# Altium schematic sheet coil_driver.SchDoc: Fan Driver
size 431 x 279 mm; Author: Shivam Sharma; DrawnBy: Fans; SheetNumber: 5; SheetTotal: 14; SheetRevision: 1.0
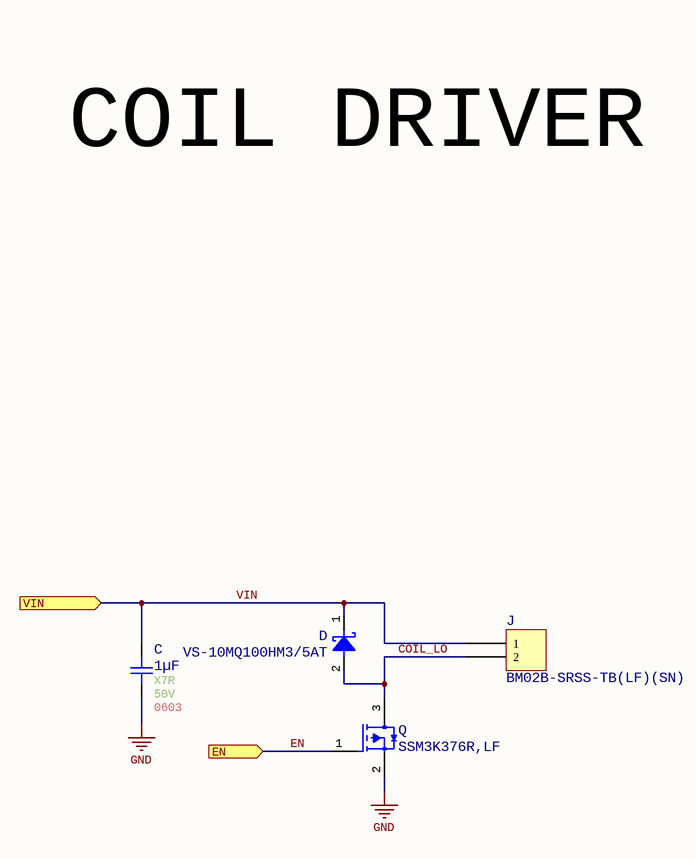
[diagram p0: coil_driver.SchDoc]

## Parts
C  value 1µF  Temperature Coefficient: X7R  Voltage Rating: 50V  Case/Package: 0603  [Generic 0603 Capacitor]  (hidden comment: CGA3E3X7R1H105K080AB)
D  VS-10MQ100HM3/5AT  [FP-95400-MFG]
J  BM02B-SRSS-TB(LF)(SN)  [JST BM02B-SRSS-TB]
Q  SSM3K376R,LF  [SSM3K376R,LF]

## Ports
EN (in), VIN (in)

## Nets
GND: C.1 Q.2(S)
COIL_LO: D.2(A) J.2 Q.3(D)
EN: Q.1(G) ; port EN
VIN: C.2 D.1(C) J.1 ; port VIN

## Notes on the sheet
- COIL DRIVER
- Title:
- Author:
- Approved:
- Size:
- Date:
- Git Hash:
- Sch Revision:
- B
- Prj:
- Sheet Revision:
- Variant:
- Edited:
- CONFIDENTIAL
- File:

## Library data of the parts
C = CMP-001-00097-2: Automotive Grade, Mlcc, 0603, X7R, 5; Tolerance: 10%; AECQ: Yes; Capacitor Type: Ceramic; RoHS Compliant: Yes; Pins: 2; Max Operating Temperature: 125°C; Min Operating Temperature: -55°C
D = CMP-00005-4: Rectifier Diode, Schottky, 1 Phase, 1 Element, 1.5A, 100V V(RRM), Silicon, DO-214AC; AECQ: Yes; Package Body Material: Plastic; Reference Standard: AEC-Q101; Forward Voltage: 780mV; Number of Elements: 1; Forward Current: 1A; Time @ Peak Reflow Temperature-Max (s): 10s; Reach SVHC Compliant: No; Terminal Finish: Tin; Surface Mount: Yes; Peak Reflow Temperature (Cel): 260°C; Package Style: SMALL OUTLINEMeter; JEDEC-95 Code: DO-214AC; Max Operating Temperature: 150°C; RoHS Compliant: Yes; Case/Package: DO-214AC; Diode Element Material: SILICON; Min Operating Temperature: -55°C; Rep Pk Reverse Voltage-Max: 100V; Moisture Sensitivity Level: 1; Diode Type: RECTIFIER; JESD-30 Code: R-PDSO-C2; JESD-609 Code: e3; Technology: SCHOTTKY; Package Shape: Rectangular; Pins: 2
J = BM02B-SRSS-TB(LF)(SN): CONN HEADER SMD 2POS 1MM; Manufacturer: JST Sales America Inc.; Current Rating (Amps): 0.7A; Material Flammability Rating: UL94 V-0; Number of Positions: 2; Number of Positions Loaded: All; Pitch - Mating: 0.039" (1.00mm); Shrouding: Shrouded - 4 Wall; Style: Board to Cable/Wire; Voltage Rating: 50V; Part Number: BM02B-SRSS-TB(LF)(SN); ComponentLink1Description: Datasheet; ComponentLink1URL: http://www.jst-mfg.com/product/pdf/eng/eSR.pdf; ComponentLink2Description: DigiKey Link; ComponentLink2URL: http://digikey.com/product-detail/en/jst-sales-america-inc/BM02B-SRSS-TB-LF-SN/455-1788-1-ND/926859; Connector Type: Header; Contact Finish - Mating: Tin; Contact Finish - Post: Tin; Contact Material: Copper Alloy; Contact Shape: Square; Contact Type: Male Pin; Fastening Type: Push-Pull; Features: Solder Retention; Insulation Color: Natural; Insulation Height: 0.167" (4.25mm); Insulation Material: Polyamide (PA), Nylon; LastUpdated: 1/12/2020 10:11:04 PM; Lifecycle Status: Active; Minimum Order: 1; Mounting Type: Surface Mount; Number of Rows: 1; Operating Temperature: -25°C ~ 85°C; Packaging: TapeAndReel; PartId: 12; Part Status: Active; Price: 0.22; Series: SR; Supplier 1: DigiKey; Supplier Part Number 1: 455-1788-1-ND; Termination: Solder
Q = CMP-013-00038-2: Transistor MOSFET N-CH 30V 4A 3-Pin SOT-23F Emboss T/R; Transistor Type: n-FET; Vgs(th) (Max) @ Id: 1V; Vgs (Max): 12V; RoHS Compliant: Yes; Max Operating Temperature: 150°C; Pins: 3; Case/Package: SOT-23F; Mounting Technology: SMD